# EAGLE design batteryholder3S2P_revB (EAGLE 9.5.2)

## Sheet 1 of 2
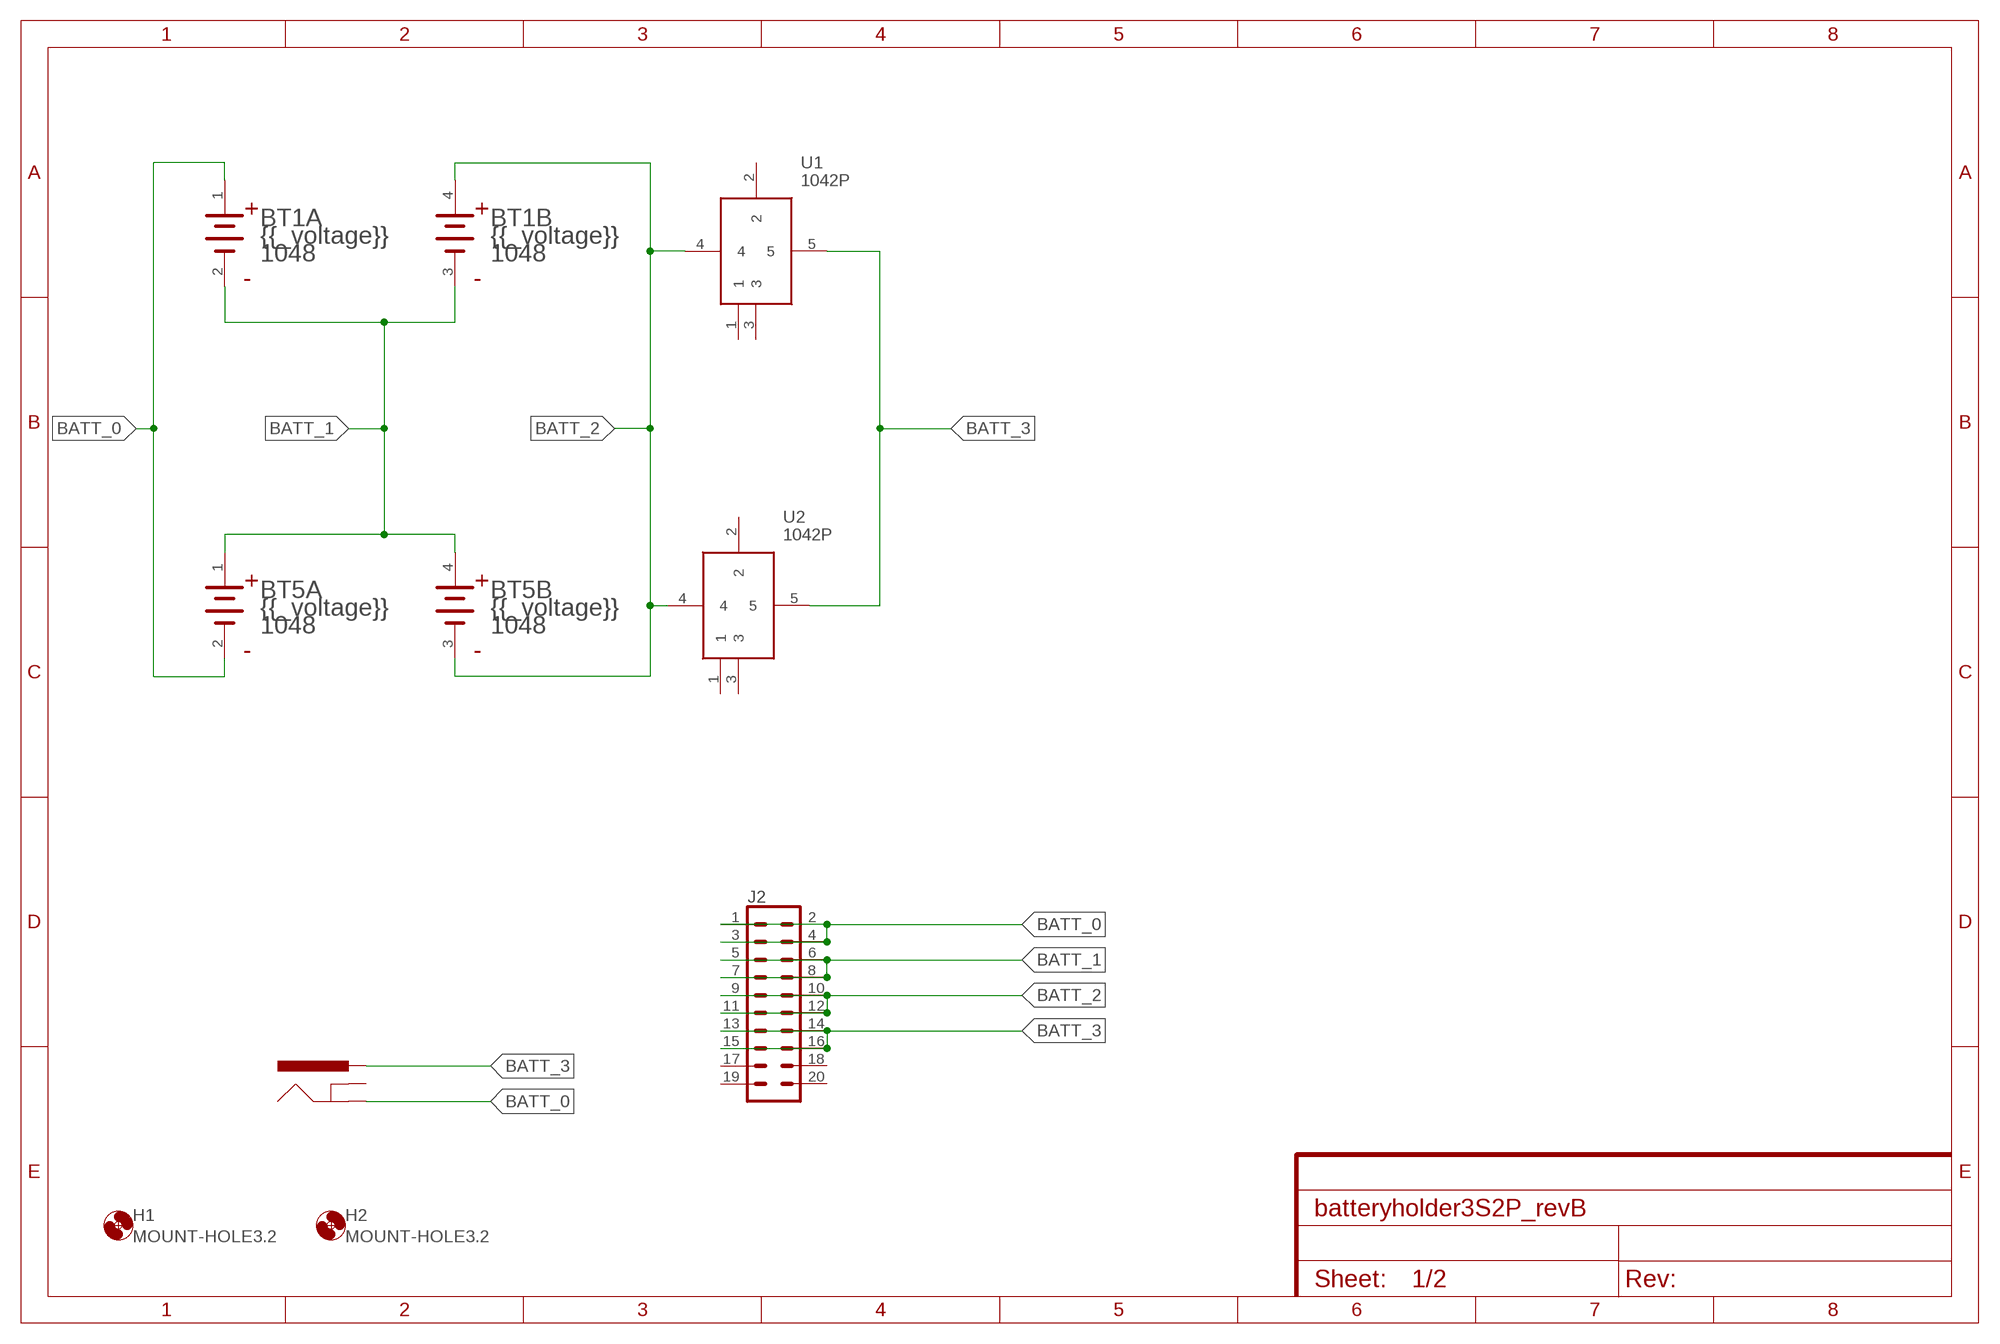
[diagram p0: schematic, sheet 1]

### Parts
BT1  KEYSTONE_1048KEYSTONE_1048_0_0  [KEYSTONE_1048_0]
BT5  KEYSTONE_1048KEYSTONE_1048_0_0  [KEYSTONE_1048_0]
H1  MOUNT-HOLE3.2  [3,2]
H2  MOUNT-HOLE3.2  [3,2]
J2  CONN_10X2NOSILK  [2X10_NOSILK]
J3  POWER_JACKPTH_BREAD  [POWER_JACK_PTH_BREAD]
U1  1042P  [1042P]
U2  1042P  [1042P]

### Nets
BATT_0 [power]: BT1.1(A:1_ANODE) BT5.2(A:1_CATHODE) J2.1 J2.2 J2.3 J2.4 J3.GND
BATT_1 [power]: BT1.2(A:1_CATHODE) BT1.3(B:2_CATHODE) BT5.1(A:1_ANODE) BT5.4(B:2_ANODE) J2.5 J2.6 J2.7 J2.8
BATT_2 [power]: BT1.4(B:2_ANODE) BT5.3(B:2_CATHODE) J2.9 J2.10 J2.11 J2.12 U1.4 U2.4
BATT_3 [power]: J2.13 J2.14 J2.15 J2.16 J3.PWR U1.5 U2.5
Unconnected: J2.17 J2.18 J2.19 J2.20 J3.GNDBREAK U1.1 U1.2 U1.3 U2.1 U2.2 U2.3

## Sheet 2 of 2

## Library data of the parts
BT1 BT5 = Keystone - 1048:KEYSTONE_1048: SMT Holder for Dual 18650 Batteries; CENTROID_NOT_SPECIFIED: No; CONN_ORIENTATION: Horizontal; CONTACT_MATERIAL: Gold,Nickel; DATASHEET: https://www.keyelco.com/userAssets/file/M65p27.pdf; DEVICE_CLASS_L1: Connectors; DEVICE_CLASS_L2: unset; DEVICE_CLASS_L3: unset; DIGIKEY_DESCRIPTION: BATT HOLDER 18650 2 CELL SMD TAB; DIGIKEY_PART_NUMBER: 36-1048-ND; FOOTPRINT_URL: https://www.keyelco.com/product-pdf.cfm?p=920; HEIGHT: 0.595inch; LEAD_FREE: yes; MF: Keystone; MFG_PACKAGE_IDENT: 1048; MFG_PACKAGE_IDENT_DATE: 0; MFG_PACKAGE_IDENT_REV: 0; MOUSER_DESCRIPTION: Battery holder SMD Dimensions L x W x H: 86 x 39.78 x 14.86 mm Suitable for: 2 x 18650; MOUSER_PART_NUMBER: 534-1048; MPN: 1048; NUMBER_OF_CONTACTS: 2; PACKAGE: SMT_BTTHLDR_18650_DUAL; PREFIX: BT; ROHS: yes; TEMPERATURE_RANGE_HIGH: +145°C; TEMPERATURE_RANGE_LOW: -50°C; VERIFICATION_VERSION: 0.0.0.1
H1 H2 = holes:MOUNT-HOLE: MOUNTING HOLE with drill center marker
J2 = SparkFun-Connectors:CONN_10X2: Multi connection point. Often used as Generic Header-pin footprint for 0.1 inch spaced/style header connections On any of the 0.1 inch spaced packages, you can populate with these: Break Away Headers - Straight <https://www.sparkfun.com/products/116> (PRT-00116) Break Away Male Headers - Right Angle <https://www.sparkfun.com/products/553> (PRT-00553) Female Headers <https://www.sparkfun.com/products/115> (PRT-00115) Break Away Headers - Machine Pin <https://www.sparkfun.com/products/117> (PRT-00117) Break Away Female Headers - Swiss Machine Pin <https://www.sparkfun.com/products/743> (PRT-00743) Special note about the "SPECIAL" package: This was SPECIALLY designed to be used with our Graphic LCD Backpack. Be sure you want to use this! It is not only staggered on each line of header holes, but IT IS ALSO offset of the center point of the top and bottom lines by 5 mil. This causes the headers to lock into place on the "standard" footprint on the LCD screen. The extra squares on the tdocu layer are there simply to reference other pins (if you were to actually populate a longer header than ten long - this is what we do with the backpacks).
J3 = SparkFun-Connectors:POWER_JACK: Power Jack Connector This is the standard 5.5mm barrel jack for power. The PTH is the most common, proven, reliable, footprint. The Slot footprint only works if the mill layer is transmitted to the PCB fab house so be warned. Here are the connectors we sell at SparkFun: DC Barrel Power Jack/Connector <https://www.sparkfun.com/products/119> (PRT-00119) DC Barrel Power Jack/Connector (SMD) <https://www.sparkfun.com/products/12748> (PRT-12748) DC Barrel Jack Adapter - Breadboard Compatible <https://www.sparkfun.com/products/10811> (PRT-10811) It is used on this SparkFun product (and many, many others): SparkFun RedBoard - Programmed with Arduino <https://www.sparkfun.com/products/12757> (DEV-12757) Also, if you need a mating power supply or connector, please check these out: Wall Adapter Power Supply - 9VDC 650mA <https://www.sparkfun.com/products/298> (TOL-00298) DC Barrel Jack Adapter - Male <https://www.sparkfun.com/products/10287> (PRT-10287); PROD_ID: PRT-10811
U1 U2 = 1042P:1042P: KEYSTONE - 1042P - BATTERY HOLDER, 18650, SMD Source: Datasheet <http://www.keyelco.com/product-pdf.cfm?p=13957>; ALLIED_NUMBER: 71135189; ALLIED_PRICE-STOCK: https://www.alliedelec.com/keystone-electronics-1042p/71135189/; DESCRIPTION: KEYSTONE - 1042P - BATTERY HOLDER, 18650, SMD; HEIGHT: 14mm; MANUFACTURER_NAME: Keystone Electronics; MANUFACTURER_PART_NUMBER: 1042P; MOUSER_PART_NUMBER: 534-1042P; MOUSER_PRICE-STOCK: https://www.mouser.com/Search/Refine.aspx?Keyword=534-1042P

## Net classes
1 power: width 1.27 mm, clearance 1.27 mm

## Board
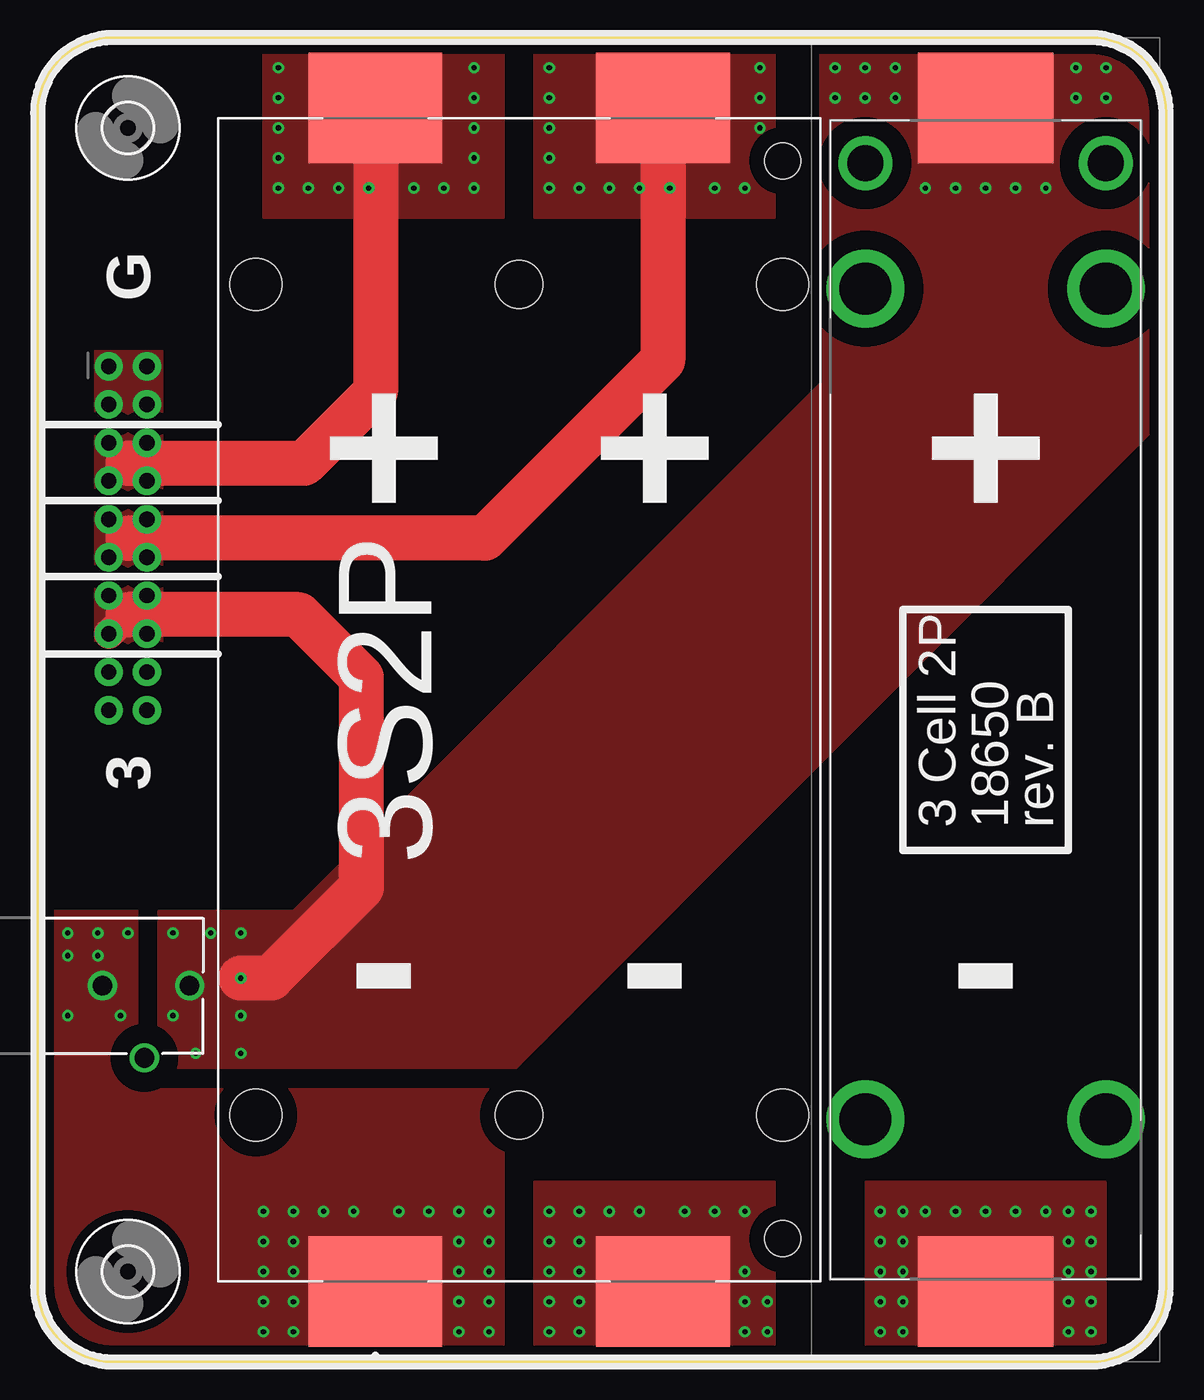
[diagram p1: board, top side]
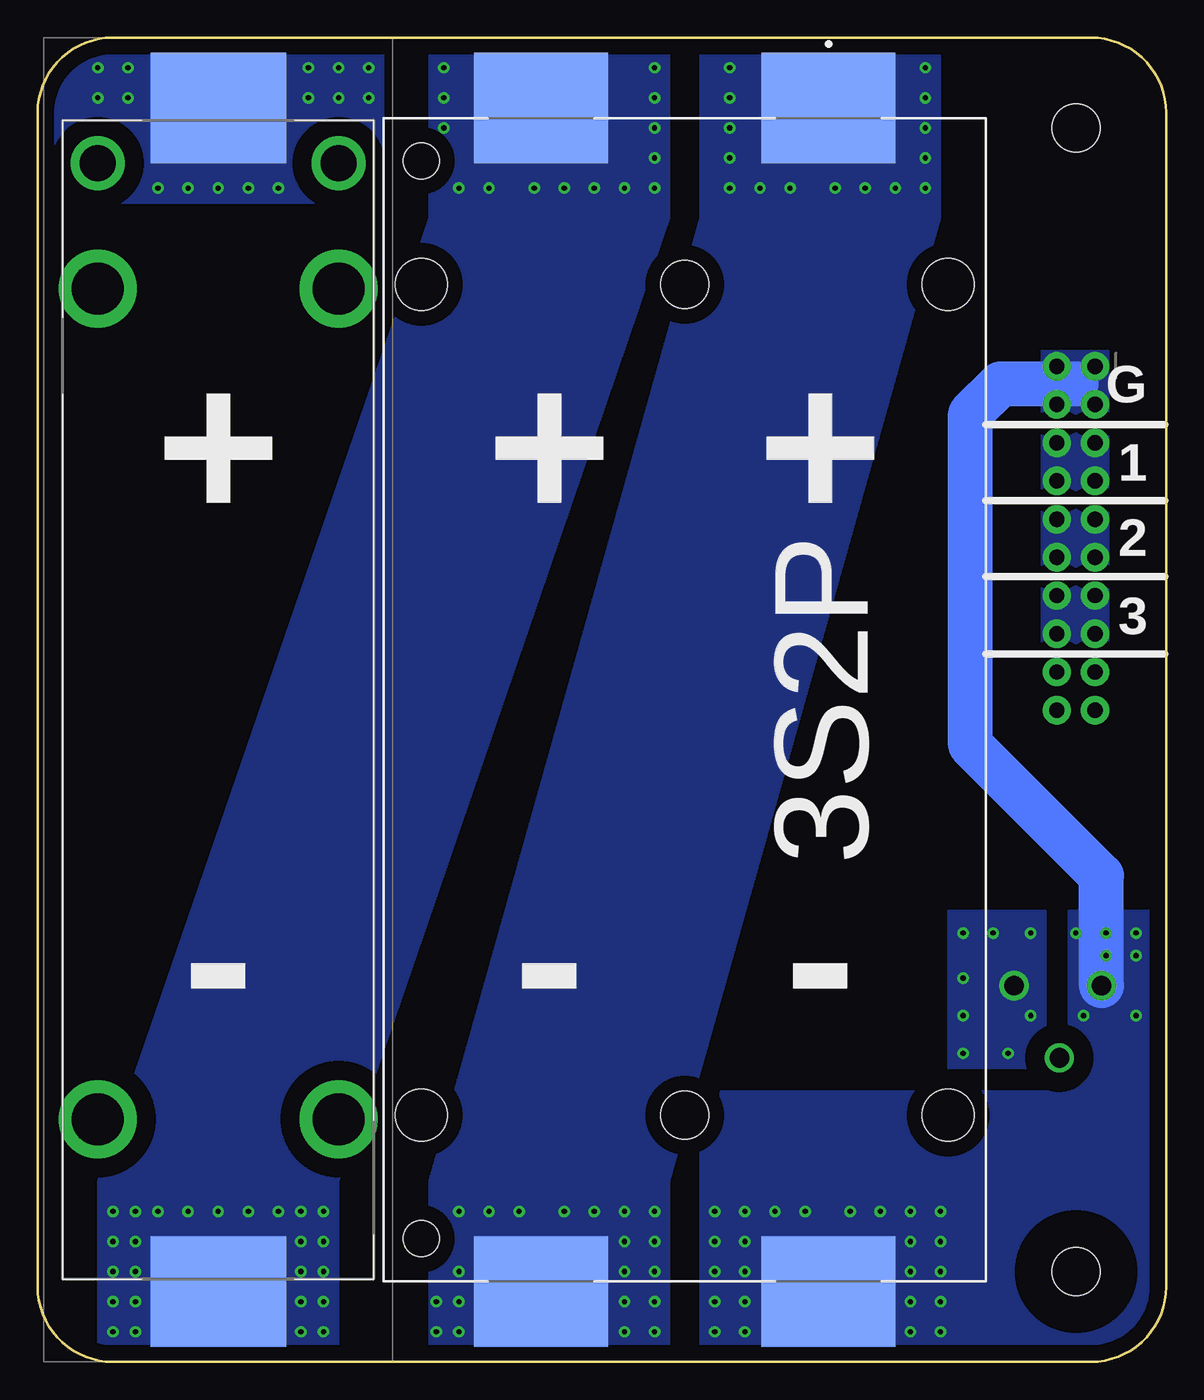
[diagram p2: board, bottom side, seen from below]

Size 75 x 88 mm. Coordinates in mm from the lower left corner, seen from the top.
Outline: 0,76 0,83 arc-90 5,88 70,88 arc-90 75,83 75,5 arc-90 70,0 5,0 arc-90 0,5 0,76.1
Copper layers (1*16): Top 0.035mm / dielectric 1.5mm / Bottom 0.035mm
Design rules "default": minimum track width 6mil, minimum drill 0.35mm, track to track 6mil, track to pad 6mil, pad to pad 6mil, via to via 6mil, smd to smd 6mil, copper to edge 40mil, drill to drill 6mil, minimum pad ring 10mil, minimum via ring 8mil, stop-mask expansion 4mil, vias tented up to drill 0mil, thermal gap 10mil

### Footprints (pad centres in the part's own frame; a part is rotated, then mirrored left to right if it is on the bottom)
KEYSTONE_1048_0 = smd 7.34 x 8.89: 1 -39.33,9.555; 2 39.33,9.555; 3 -39.33,-9.555; 4 39.33,-9.555 | hole 3.45: 27.6,17.505; -27.6,-17.505 | hole 2.39: 35.82,-17.505 | hole 3.17: 27.6,0; -27.6,0
3,2 = hole 3.2: 0,0
2X10_NOSILK = drill 1.016 pad 1.88: 1 0,0; 2 0,2.54; 3 2.54,0; 4 2.54,2.54; 5 5.08,0; 6 5.08,2.54; 7 7.62,0; 8 7.62,2.54; 9 10.16,0; 10 10.16,2.54; 11 12.7,0; 12 12.7,2.54; 13 15.24,0; 14 15.24,2.54; 15 17.78,0; 16 17.78,2.54; 17 20.32,0; 18 20.32,2.54; 19 22.86,0; 20 22.86,2.54
POWER_JACK_PTH_BREAD = drill 1.3: GND 0,7.9; GNDBREAK 4.8,10.7; PWR 0,13.7
1042P = drill 3.45 pad 5.175: 1 -27.87,-8; 2 27.33,8 | drill 2.39 pad 3.585: 3 35.66,-8 | smd 7.34 x 9: 4 -39.33,0; 5 39.33,0

### Placement (x,y rotation side)
BT1  32,44 90 top
BT5  32,44 270 bottom
H1  6,82 0 top
H2  6,6 0 top
J2  4.73,66.16 270 top
J3  -3.6,25 270 top
U1  63,44 90 top
U2  63,44 90 bottom

### Tracks (layer width: path | path; a pad name or v marks a point on that pad's centre or on a via)
BATT_0  (via drill 0.35)
  Bottom 3: J3.GND 4.3,32.3 13,41 13,63 11,65 6,65
  other vias: 5.5,23 2,28.5 4,28.5 2,27 4,27 2,23 6,28.5 30,2 30,4 30,6 30,8 30,10 28,10 26,10 24,10 21,10 19,10 17,10 15,10 15,8 15,6 15,4 15,2 28,4 28,6 28,8 28,2 17,2 17,4 17,6 17,8
  pour Top (rank 2, no thermals): 0,30 31,30 31,0 0,0
  pour Bottom (rank 2, no thermals): 0,18 0,0 31,0 31,18
  pour Bottom (no thermals): 6.5,0 0,0 0,30 6.5,30
  pour Bottom (no thermals): 8.3,67.2 3.8,67.2 3.8,62.6 8.3,62.6
  pour Top (no thermals): 8.3,67.2 3.8,67.2 3.8,62.6 8.3,62.6
BATT_1  (via drill 0.35)
  Top 2: 23,83 22.67,83.33 BT5.1
  Top 3: BT5.1 22.45,64.44 17.71,59.71 6,59.71
  other vias: 16,86 16,84 16,82 16,80 16,78 18,78 29,78 29,80 29,82 29,84 29,86 27,78 25,78 20,78 48.5,2 48.5,4 47,4 47,2 36,2 34,2 34,4 36,4 34,6 34,8 34,10 36,8 47,6 36,6 36,10 38,10 40,10 47,10 45,10 43,10 22,78
  pour Top (no thermals): 15,88 15,76 31,76 31,88
  pour Top (no thermals): 33,0 33,12 49,12 49,0
  pour Bottom (no thermals): 15,88 15,76 33,12 33,0 49,0 49,12 31,76 31,88
  pour Bottom (no thermals): 3.8,62 3.8,57.5 8.3,57.5 8.3,62
  pour Top (no thermals): 3.8,62 3.8,57.5 8.3,57.5 8.3,62
BATT_2  (via drill 0.35)
  Top 2: 6,54.73 6,55
  Top 3: BT5.3 41.55,66.56 29.73,54.73 6,54.73
  other vias: 34,86 34,84 34,82 34,80 34,78 36,78 38,78 40,78 48,86 48,84 48,82 47,78 45,78 42,78 70,2 70,4 70,6 70,8 70,10 68.5,2 68.5,4 68.5,6 68.5,8 68.5,10 67,10 65,10 56,10 56,8 56,6 56,4 56,2 57.5,2 57.5,4 57.5,6 57.5,8 57.5,10 59,10 61,10 63,10
  pour Top (no thermals): 33,88 33,76 49,76 49,88
  pour Top (no thermals): 55,0 55,12 71,12 71,0
  pour Bottom (no thermals): 33,88 33,76 55,12 55,0 71,0 71,12 49,76 49,88
  pour Bottom (no thermals): 3.8,56.9 3.8,52.5 8.3,52.5 8.3,56.9
  pour Top (no thermals): 3.8,56.9 3.8,52.5 8.3,52.5 8.3,56.9
BATT_3  (via drill 0.35)
  Top 2: 6,50 6,49.65 J2.15
  Top 3: 14.5,25.5 v13.5,25.5 15.5,25.5 21.5,31.5 21.5,45.5 17.35,49.65 6,49.65
  other vias: 9,28.5 9,23 10.5,20.5 13.5,20.5 13.5,28.5 11.5,28.5 53,86 55,86 57,86 57,84 55,84 53,84 69,84 71,84 69,86 71,86 67,78 65,78 63,78 61,78 59,78 13.5,23
  pour Top (no thermals): 75,88 52,88 52,65 17,30 8,30 8,19.5 31.8,19.5 75,62.79
  pour Bottom (no thermals): 52,88 52,77 75,77 75,88
  pour Bottom (no thermals): 8,30 8,19.5 14.5,19.5 14.5,30
  pour Bottom (no thermals): 3.8,51.9 3.8,47.4 8.3,47.4 8.3,51.9
  pour Top (no thermals): 3.8,51.9 3.8,47.4 8.3,47.4 8.3,51.9

### Text on the board
tPlace: G | + | + | + | 3S2P | 3 | 3 Cell 2P | 18650 | rev. B | - | - | -
bPlace: G | 1 | + | + | + | 2 | 3 | 3S2P | - | - | -